# Altium schematic sheet Flash_Debug.SchDoc
size A4
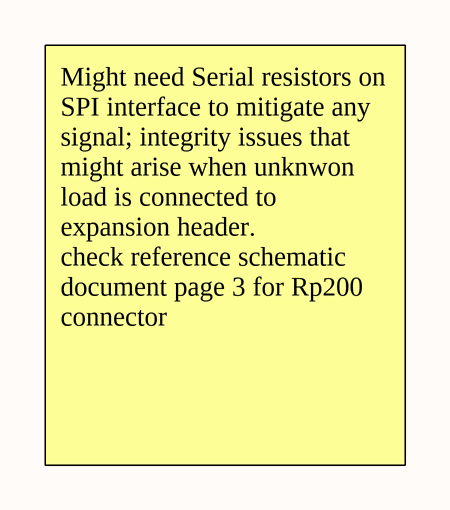
[diagram p0: Flash_Debug.SchDoc]

## Notes on the sheet
- Might need Serial resistors on SPI interface to mitigate any signal; integrity issues that might arise when unknwon load is connected to expansion header.
  check reference schematic  document page 3 for Rp200 connector
- Title
- Size:
- Date:
- A4
- Number:
- Time:
- Revision:
- Sheet
- of
- File: